# EAGLE design H-Bridge-no_enable (EAGLE 7.6.0)
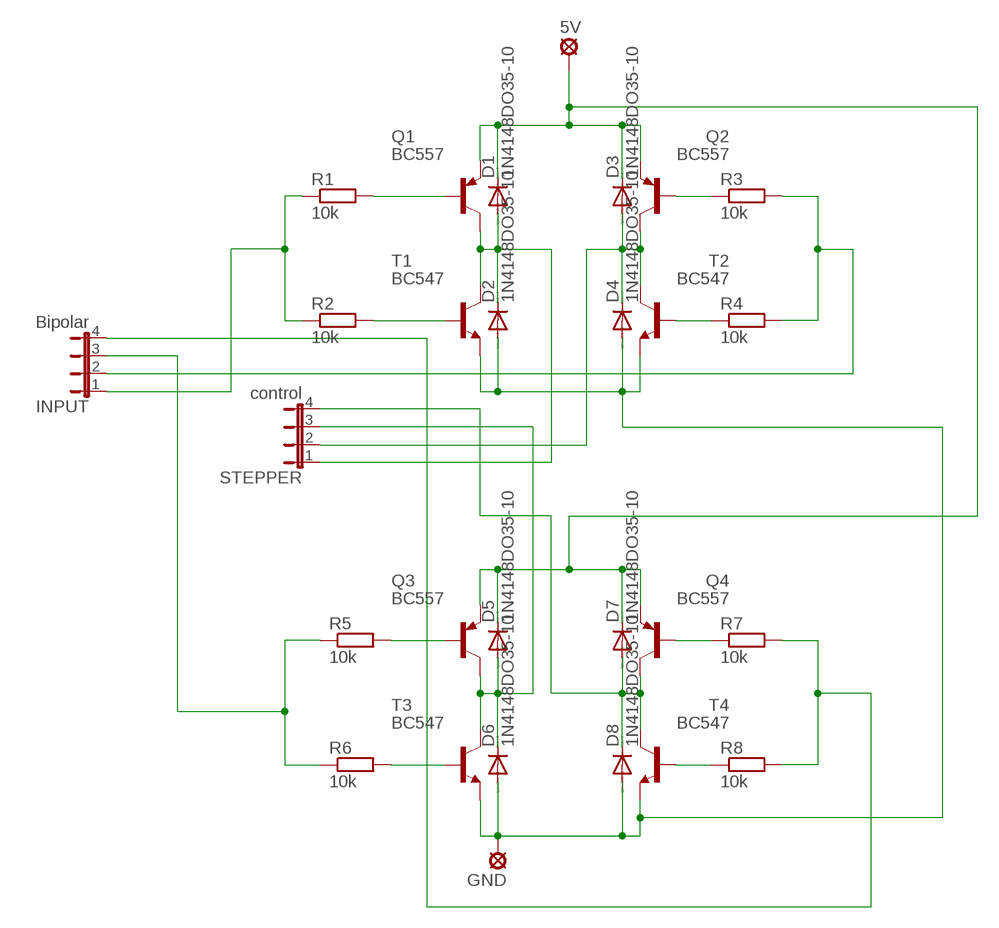
[diagram p0: schematic, sheet 1]

## Parts
5V  LSP10  [LSP10]
D1  1N4148DO35-10  [DO35-10]
D2  1N4148DO35-10  [DO35-10]
D3  1N4148DO35-10  [DO35-10]
D4  1N4148DO35-10  [DO35-10]
D5  1N4148DO35-10  [DO35-10]
D6  1N4148DO35-10  [DO35-10]
D7  1N4148DO35-10  [DO35-10]
D8  1N4148DO35-10  [DO35-10]
GND  LSP10  [LSP10]
INPUT  Bipolar  JP4E  [JP4]
Q1  BC557  [TO92]
Q2  BC557  [TO92]
Q3  BC557  [TO92]
Q4  BC557  [TO92]
R1  10k  R-EU_0204/2V  [0204V]
R2  10k  R-EU_0204/2V  [0204V]
R3  10k  R-EU_0204/2V  [0204V]
R4  10k  R-EU_0204/2V  [0204V]
R5  10k  R-EU_0204/2V  [0204V]
R6  10k  R-EU_0204/2V  [0204V]
R7  10k  R-EU_0204/2V  [0204V]
R8  10k  R-EU_0204/2V  [0204V]
STEPPER  control  JP4E  [JP4]
T1  BC547  [TO92]
T2  BC547  [TO92]
T3  BC547  [TO92]
T4  BC547  [TO92]

## Nets
N$1: INPUT.1 R1.1 R2.1
N$2: Q1.2(B) R1.2
N$3: R2.2 T1.2(B)
N$4: D1.A D2.C Q1.3(C) STEPPER.1 T1.3(C)
N$5: D3.A D4.C Q2.3(C) STEPPER.2 T2.3(C)
N$6: Q2.2(B) R3.1
N$7: R4.1 T2.2(B)
N$8: INPUT.2 R3.2 R4.2
N$9: D2.A D4.A D6.A D8.A GND.MP T1.1(E) T2.1(E) T3.1(E) T4.1(E)
N$11: INPUT.3 R5.1 R6.1
N$12: Q3.2(B) R5.2
N$13: R6.2 T3.2(B)
N$14: D5.A D6.C Q3.3(C) STEPPER.3 T3.3(C)
N$15: D7.A D8.C Q4.3(C) STEPPER.4 T4.3(C)
N$16: Q4.2(B) R7.1
N$17: R8.1 T4.2(B)
N$18: INPUT.4 R7.2 R8.2
N$20: 5V.MP D1.C D3.C D5.C D7.C Q1.1(E) Q2.1(E) Q3.1(E) Q4.1(E)

## Library data of the parts
5V GND = solpad:LSP10: SOLDER PAD drill 1.0 mm, distributor Buerklin, 12H555
D1-D8 = diode:1N4148: DIODE high speed (Philips)
INPUT STEPPER = jumper:JP4E: JUMPER
Q1-Q4 = transistor-pnp:BC557: PNP Transistor
R1-R8 = rcl:R-EU_: RESISTOR, European symbol
T1-T4 = transistor-neu-to92:BC547: NPN TRANSISTOR

## Board
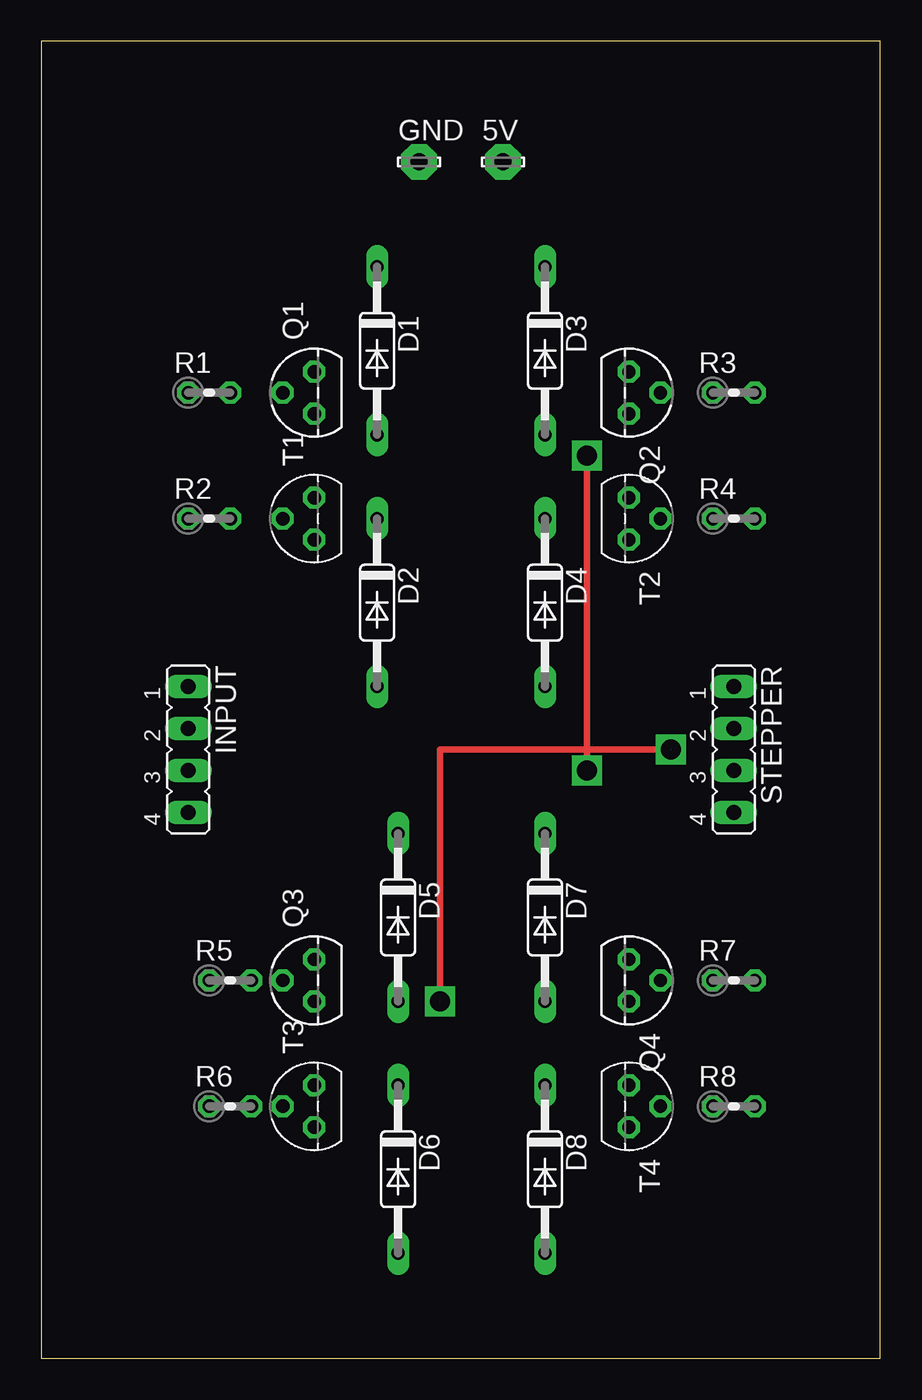
[diagram p1: board, top side]
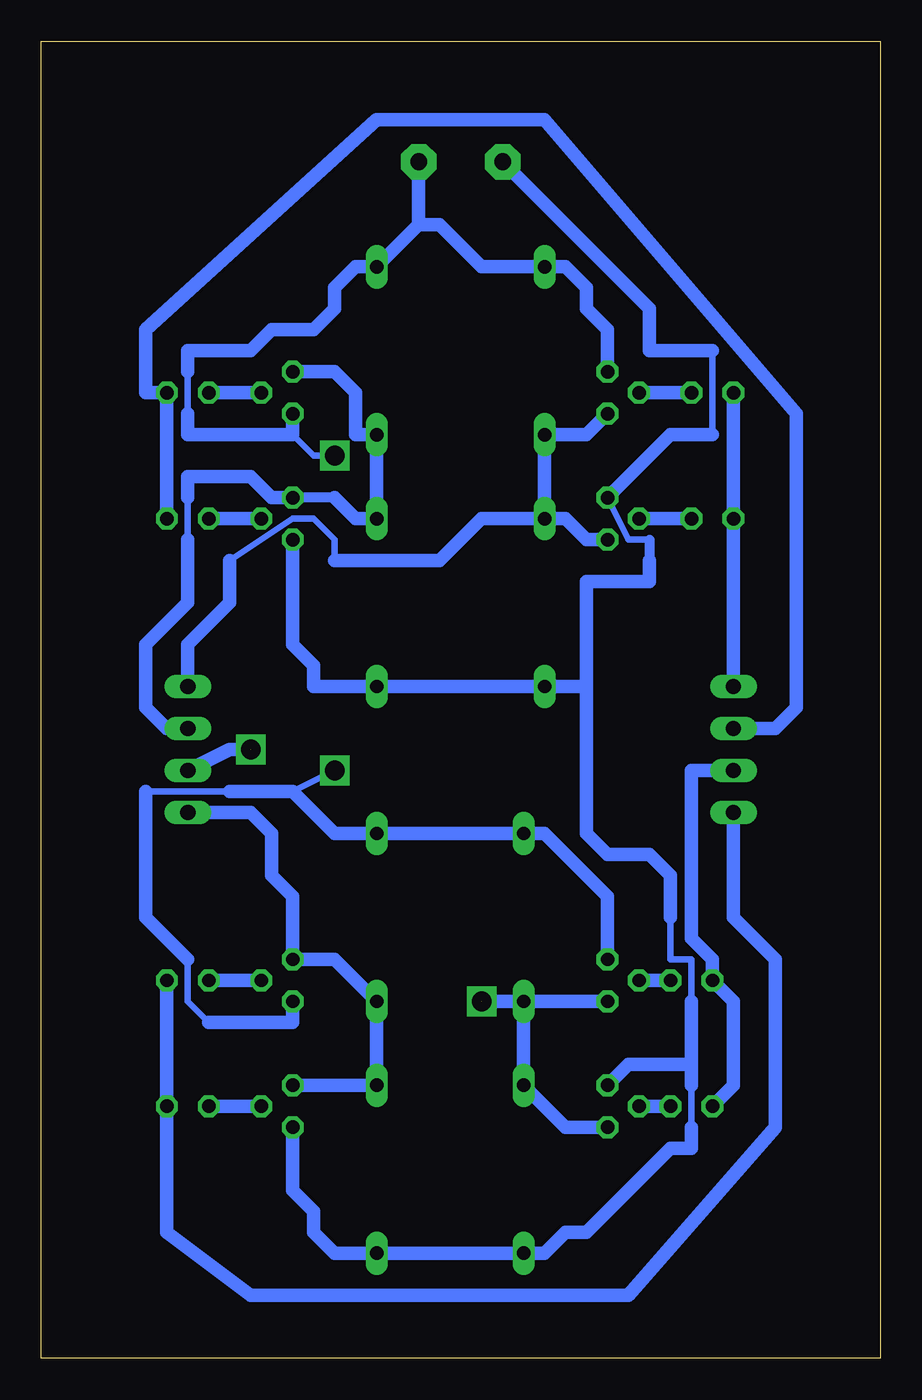
[diagram p2: board, bottom side, seen from below]

Size 50.78 x 79.68 mm. Coordinates in mm from the lower left corner, seen from the top.
Outline: 0,0 50.78,0 50.78,79.68 0,79.68 0,0
Copper layers (1*16): Top 0.035mm / dielectric 1.5mm / Bottom 0.035mm
Design rules "default": minimum track width 10mil, minimum drill 24mil, track to track 8mil, track to pad 8mil, pad to pad 8mil, via to via 8mil, smd to smd 8mil, copper to edge 40mil, drill to drill 8mil, minimum pad ring 10mil, minimum via ring 8mil, stop-mask expansion 4mil, vias tented up to drill 0mil, thermal gap 10mil

### Footprints (pad centres in the part's own frame; a part is rotated, then mirrored left to right if it is on the bottom)
LSP10 = drill 1.016 pad 2.159 octagon: MP 0,0
DO35-10 = drill 0.813 long: A 5.08,0; C -5.08,0
JP4 = drill 0.914 long: 1 -3.81,0; 2 -1.27,0; 3 1.27,0; 4 3.81,0
TO92 = drill 0.813 octagon: 1 1.27,0; 2 0,1.905; 3 -1.27,0
0204V = drill 0.813 octagon: 1 -1.27,0; 2 1.27,0

### Placement (x,y rotation side)
5V  27.94,72.39 0 top
D1  20.32,60.96 270 top
D2  20.32,45.72 270 top
D3  30.48,60.96 270 top
D4  30.48,45.72 270 top
D5  21.59,26.67 270 top
D6  21.59,11.43 270 top
D7  30.48,26.67 270 top
D8  30.48,11.43 270 top
GND  22.86,72.39 0 top
INPUT  8.89,36.83 270 top
Q1  16.51,58.42 90 top
Q2  35.56,58.42 270 top
Q3  16.51,22.86 90 top
Q4  35.56,22.86 270 top
R1  10.16,58.42 0 top
R2  10.16,50.8 0 top
R3  41.91,58.42 0 top
R4  41.91,50.8 0 top
R5  11.43,22.86 0 top
R6  11.43,15.24 0 top
R7  41.91,22.86 0 top
R8  41.91,15.24 0 top
STEPPER  41.91,36.83 270 top
T1  16.51,50.8 90 top
T2  35.56,50.8 270 top
T3  16.51,15.24 90 top
T4  35.56,15.24 270 top

### Tracks (layer width: path | path; a pad name or v marks a point on that pad's centre or on a via)
N$1
  Bottom 0.813: R1.1 R2.1 INPUT.1
N$2
  Bottom 0.813: Q1.2 R1.2
N$3
  Bottom 0.813: T1.2 R2.2
N$4
  Bottom 0.406: 33.02,48.26 33.02,49.53 34.29,50.8 35.56,50.8 39.37,48.26
  Bottom 0.813: Q1.3 17.78,55.88 D1.A D2.C | T1.3 17.78,49.53 19.05,50.8 D2.C | STEPPER.1 41.91,43.18 39.37,45.72 39.37,48.26 | D2.C 24.13,50.8 26.67,48.26 33.02,48.26
N$5
  Bottom 0.406: 41.91,52.07 41.91,49.53
  Bottom 0.61: 33.02,52.07 T2.3
  Bottom 0.813: 33.02,52.07 31.75,50.8 D4.C D3.A 31.75,55.88 31.75,58.42 33.02,59.69 Q2.3 | 41.91,52.07 41.91,53.34 38.1,53.34 36.83,52.07 T2.3 | STEPPER.2 43.18,38.1 44.45,39.37 44.45,43.18 41.91,45.72 41.91,49.53
N$6
  Bottom 0.813: Q2.2 R3.1
N$7
  Bottom 0.813: T2.2 R4.1
N$8
  Bottom 0.813: R4.2 R3.2 44.45,58.42 44.45,62.23 30.48,74.93 20.32,74.93 5.08,57.15 5.08,39.37 6.35,38.1 INPUT.2
N$9
  Bottom 0.406: 11.43,13.97 11.43,16.51 | 10.16,60.96 10.16,55.88 | T1.1 15.24,49.53 13.97,49.53 | 11.43,21.59 11.43,24.13 12.7,24.13 12.7,26.67
  Bottom 0.61: 13.97,49.53 13.97,48.26
  Bottom 0.813: T4.1 35.56,10.16 34.29,8.89 34.29,7.62 33.02,6.35 D8.A D6.A 20.32,6.35 19.05,7.62 17.78,7.62 12.7,12.7 11.43,12.7 11.43,13.97 | T3.1 15.24,17.78 11.43,17.78 | 11.43,17.78 11.43,16.51 | T2.1 35.56,43.18 34.29,41.91 34.29,40.64 D4.A D2.A 17.78,40.64 | GND.MP 13.97,63.5 13.97,60.96 10.16,60.96 | T1.1 12.7,55.88 10.16,55.88 | 13.97,48.26 13.97,46.99 17.78,46.99 17.78,40.64 | 11.43,17.78 11.43,21.59 | 12.7,26.67 12.7,29.21 13.97,30.48 16.51,30.48 17.78,31.75 17.78,40.64
N$10  (via drill 1.2)
  other vias: 38.1,36.83
N$11
  Bottom 0.813: R6.1 8.89,16.51 8.89,21.59 R5.1 10.16,24.13 11.43,25.4 11.43,35.56 INPUT.3
N$12
  Bottom 0.813: R5.2 Q3.2
N$13
  Bottom 0.813: R6.2 T3.2
N$14  (2 unrouted)
  Top 0.406: 24.13,21.59 24.13,36.83 38.1,36.83
  Bottom 0.813: D5.A D6.C 19.05,13.97 T3.3 | Q3.3 D5.A | STEPPER.3 39.37,36.83 38.1,36.83 | D5.A 24.13,21.59
N$15
  Bottom 0.813: T4.3 D8.C D7.A 33.02,24.13 Q4.3 35.56,27.94 36.83,29.21 36.83,31.75 38.1,33.02 STEPPER.4
N$16
  Bottom 0.813: Q4.2 R7.1
N$17
  Bottom 0.813: T4.2 R8.1
N$18
  Bottom 0.813: R7.2 R8.2 43.18,7.62 38.1,3.81 15.24,3.81 6.35,13.97 6.35,24.13 8.89,26.67 INPUT.4
N$19  (via drill 1.2)
  other vias: 24.13,21.59
N$20  (via drill 1.2)
  Top 0.406: v33.02,54.61 v33.02,35.56
  Bottom 0.406: 39.37,34.29 44.45,34.29 | 41.91,24.13 41.91,21.59 40.64,20.32 | 41.91,59.69 41.91,57.15 | 35.56,55.88 34.29,54.61 v33.02,54.61 | 35.56,34.29 v33.02,35.56
  Bottom 0.813: Q3.1 16.51,27.94 20.32,31.75 D5.C D7.C 33.02,31.75 35.56,34.29 39.37,34.29 | 44.45,34.29 44.45,26.67 41.91,24.13 | Q4.1 35.56,20.32 40.64,20.32 | Q1.1 16.51,62.23 17.78,63.5 17.78,64.77 19.05,66.04 D1.C 24.13,66.04 26.67,68.58 27.94,68.58 | 27.94,68.58 D3.C 31.75,66.04 33.02,64.77 33.02,63.5 34.29,62.23 36.83,62.23 38.1,60.96 41.91,60.96 41.91,59.69 | 27.94,68.58 5V.MP | Q2.1 35.56,55.88 41.91,55.88 41.91,57.15